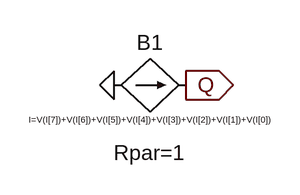
[diagram p0: schematic 1counter_8bit-fast.asc]
1counter_8bit-fast.asc, the LTspice schematic file:
Version 4
SHEET 1 880 680
FLAG 320 128 Q
IOPIN 320 128 Out
FLAG 240 128 0
SYMBOL bi 240 128 R270
WINDOW 0 32 40 VTop 2
WINDOW 3 -32 40 VBottom 0
WINDOW 123 -60 40 VBottom 2
SYMATTR InstName B1
SYMATTR Value I=V(I[7])+V(I[6])+V(I[5])+V(I[4])+V(I[3])+V(I[2])+V(I[1])+V(I[0])
SYMATTR Value2 Rpar=1

The netlist it stands for:
* 1counter_8bit-fast.asc
B1 0 Q I=V(I[7])+V(I[6])+V(I[5])+V(I[4])+V(I[3])+V(I[2])+V(I[1])+V(I[0]) Rpar=1
.backanno
.end